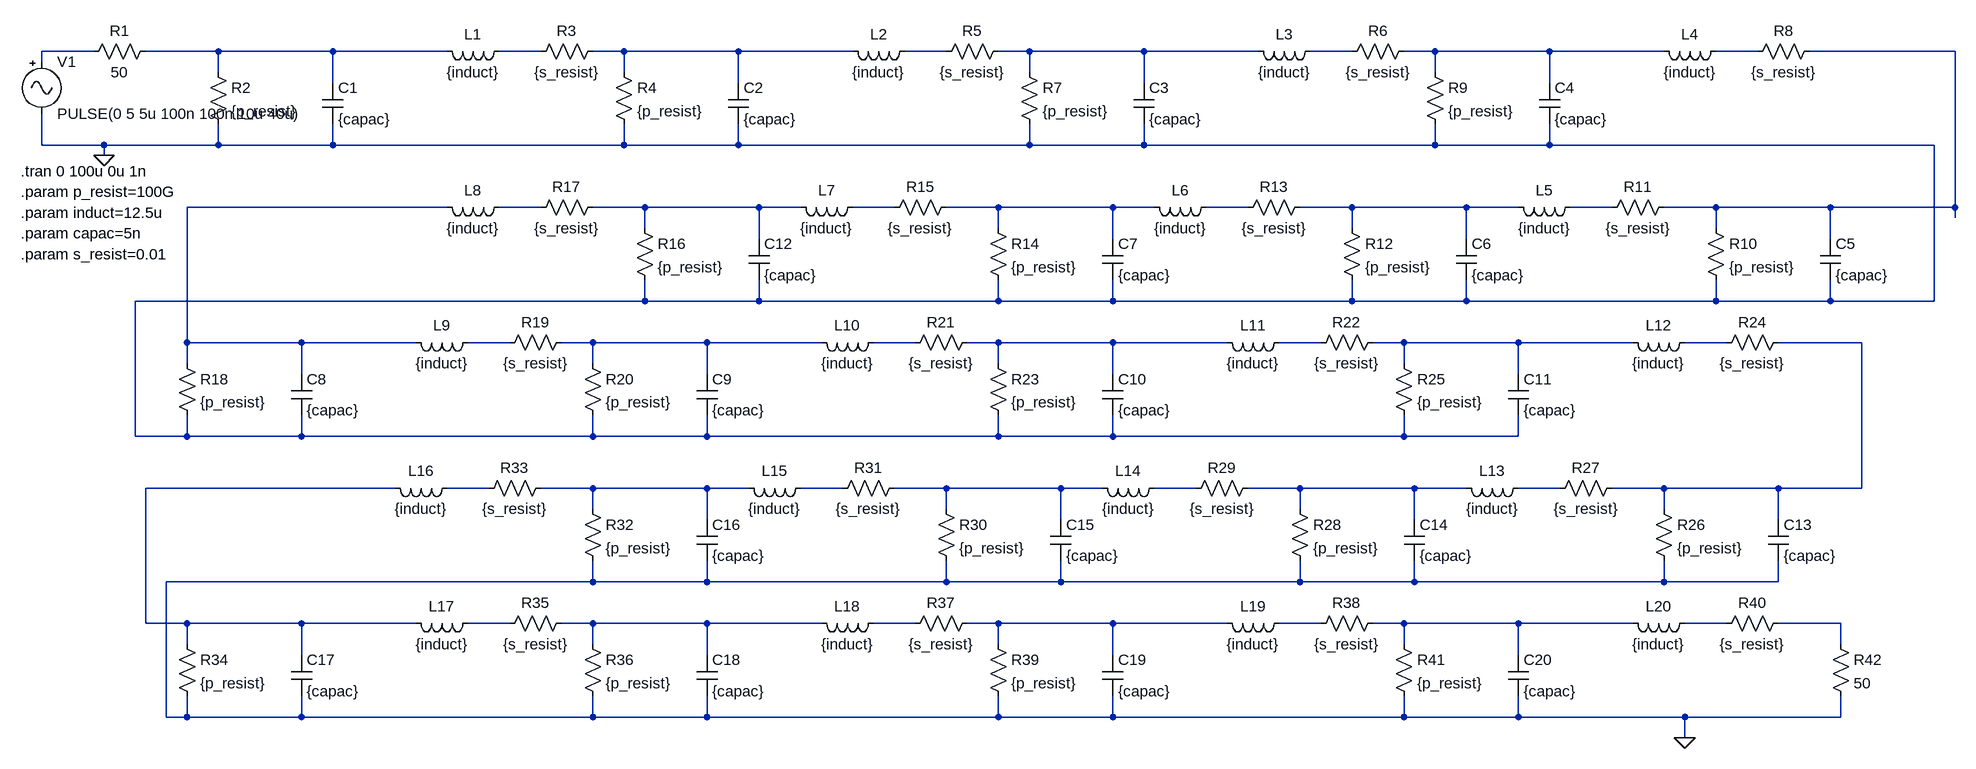
[diagram p0: schematic lossy.asc]
lossy.asc, the LTspice schematic file:
Version 4
SHEET 1 2904 900
WIRE -560 -176 -640 -176
WIRE -368 -176 -480 -176
WIRE -192 -176 -368 -176
WIRE -16 -176 -192 -176
WIRE 128 -176 64 -176
WIRE 256 -176 208 -176
WIRE 432 -176 256 -176
WIRE 608 -176 432 -176
WIRE 752 -176 688 -176
WIRE 880 -176 832 -176
WIRE 1056 -176 880 -176
WIRE 1232 -176 1056 -176
WIRE 1376 -176 1312 -176
WIRE 1504 -176 1456 -176
WIRE 1680 -176 1504 -176
WIRE 1856 -176 1680 -176
WIRE 2000 -176 1936 -176
WIRE 2304 -176 2080 -176
WIRE -640 -160 -640 -176
WIRE -368 -144 -368 -176
WIRE 256 -144 256 -176
WIRE 880 -144 880 -176
WIRE 1504 -144 1504 -176
WIRE -192 -128 -192 -176
WIRE 432 -128 432 -176
WIRE 1056 -128 1056 -176
WIRE 1680 -128 1680 -176
WIRE -640 -32 -640 -80
WIRE -544 -32 -640 -32
WIRE -368 -32 -368 -64
WIRE -368 -32 -544 -32
WIRE -192 -32 -192 -64
WIRE -192 -32 -368 -32
WIRE 256 -32 256 -64
WIRE 256 -32 -192 -32
WIRE 432 -32 432 -64
WIRE 432 -32 256 -32
WIRE 880 -32 880 -64
WIRE 880 -32 432 -32
WIRE 1056 -32 1056 -64
WIRE 1056 -32 880 -32
WIRE 1504 -32 1504 -64
WIRE 1504 -32 1056 -32
WIRE 1680 -32 1680 -64
WIRE 1680 -32 1504 -32
WIRE 2272 -32 1680 -32
WIRE -544 -16 -544 -32
WIRE -16 64 -416 64
WIRE 128 64 64 64
WIRE 288 64 208 64
WIRE 464 64 288 64
WIRE 528 64 464 64
WIRE 672 64 608 64
WIRE 832 64 752 64
WIRE 1008 64 832 64
WIRE 1072 64 1008 64
WIRE 1216 64 1152 64
WIRE 1376 64 1296 64
WIRE 1552 64 1376 64
WIRE 1632 64 1552 64
WIRE 1776 64 1712 64
WIRE 1936 64 1856 64
WIRE 2112 64 1936 64
WIRE 2304 64 2304 -176
WIRE 2304 64 2112 64
WIRE 2304 80 2304 64
WIRE 288 96 288 64
WIRE 832 96 832 64
WIRE 1376 96 1376 64
WIRE 1936 96 1936 64
WIRE 464 112 464 64
WIRE 1008 112 1008 64
WIRE 1552 112 1552 64
WIRE 2112 112 2112 64
WIRE 288 208 288 176
WIRE 288 208 -496 208
WIRE 464 208 464 176
WIRE 464 208 288 208
WIRE 832 208 832 176
WIRE 832 208 464 208
WIRE 1008 208 1008 176
WIRE 1008 208 832 208
WIRE 1376 208 1376 176
WIRE 1376 208 1008 208
WIRE 1552 208 1552 176
WIRE 1552 208 1376 208
WIRE 1936 208 1936 176
WIRE 1936 208 1552 208
WIRE 2112 208 2112 176
WIRE 2112 208 1936 208
WIRE 2272 208 2272 -32
WIRE 2272 208 2112 208
WIRE -416 272 -416 64
WIRE -240 272 -416 272
WIRE -64 272 -240 272
WIRE 80 272 16 272
WIRE 208 272 160 272
WIRE 384 272 208 272
WIRE 560 272 384 272
WIRE 704 272 640 272
WIRE 832 272 784 272
WIRE 1008 272 832 272
WIRE 1184 272 1008 272
WIRE 1328 272 1264 272
WIRE 1456 272 1408 272
WIRE 1632 272 1456 272
WIRE 1808 272 1632 272
WIRE 1952 272 1888 272
WIRE 2160 272 2032 272
WIRE -416 304 -416 272
WIRE 208 304 208 272
WIRE 832 304 832 272
WIRE 1456 304 1456 272
WIRE -240 320 -240 272
WIRE 384 320 384 272
WIRE 1008 320 1008 272
WIRE 1632 320 1632 272
WIRE -496 416 -496 208
WIRE -416 416 -416 384
WIRE -416 416 -496 416
WIRE -240 416 -240 384
WIRE -240 416 -416 416
WIRE 208 416 208 384
WIRE 208 416 -240 416
WIRE 384 416 384 384
WIRE 384 416 208 416
WIRE 832 416 832 384
WIRE 832 416 384 416
WIRE 1008 416 1008 384
WIRE 1008 416 832 416
WIRE 1456 416 1456 384
WIRE 1456 416 1008 416
WIRE 1632 416 1632 384
WIRE 1632 416 1456 416
WIRE -96 496 -480 496
WIRE 48 496 -16 496
WIRE 208 496 128 496
WIRE 384 496 208 496
WIRE 448 496 384 496
WIRE 592 496 528 496
WIRE 752 496 672 496
WIRE 928 496 752 496
WIRE 992 496 928 496
WIRE 1136 496 1072 496
WIRE 1296 496 1216 496
WIRE 1472 496 1296 496
WIRE 1552 496 1472 496
WIRE 1696 496 1632 496
WIRE 1856 496 1776 496
WIRE 2032 496 1856 496
WIRE 2160 496 2160 272
WIRE 2160 496 2032 496
WIRE 208 528 208 496
WIRE 752 528 752 496
WIRE 1296 528 1296 496
WIRE 1856 528 1856 496
WIRE 384 544 384 496
WIRE 928 544 928 496
WIRE 1472 544 1472 496
WIRE 2032 544 2032 496
WIRE 208 640 208 608
WIRE 208 640 -448 640
WIRE 384 640 384 608
WIRE 384 640 208 640
WIRE 752 640 752 608
WIRE 752 640 384 640
WIRE 928 640 928 608
WIRE 928 640 752 640
WIRE 1296 640 1296 608
WIRE 1296 640 928 640
WIRE 1472 640 1472 608
WIRE 1472 640 1296 640
WIRE 1856 640 1856 608
WIRE 1856 640 1472 640
WIRE 2032 640 2032 608
WIRE 2032 640 1856 640
WIRE -480 704 -480 496
WIRE -416 704 -480 704
WIRE -240 704 -416 704
WIRE -64 704 -240 704
WIRE 80 704 16 704
WIRE 208 704 160 704
WIRE 384 704 208 704
WIRE 560 704 384 704
WIRE 704 704 640 704
WIRE 832 704 784 704
WIRE 1008 704 832 704
WIRE 1184 704 1008 704
WIRE 1328 704 1264 704
WIRE 1456 704 1408 704
WIRE 1632 704 1456 704
WIRE 1808 704 1632 704
WIRE 1952 704 1888 704
WIRE 2128 704 2032 704
WIRE -416 736 -416 704
WIRE 208 736 208 704
WIRE 832 736 832 704
WIRE 1456 736 1456 704
WIRE 2128 736 2128 704
WIRE -240 752 -240 704
WIRE 384 752 384 704
WIRE 1008 752 1008 704
WIRE 1632 752 1632 704
WIRE -448 848 -448 640
WIRE -416 848 -416 816
WIRE -416 848 -448 848
WIRE -240 848 -240 816
WIRE -240 848 -416 848
WIRE 208 848 208 816
WIRE 208 848 -240 848
WIRE 384 848 384 816
WIRE 384 848 208 848
WIRE 832 848 832 816
WIRE 832 848 384 848
WIRE 1008 848 1008 816
WIRE 1008 848 832 848
WIRE 1456 848 1456 816
WIRE 1456 848 1008 848
WIRE 1632 848 1632 816
WIRE 1632 848 1456 848
WIRE 1888 848 1632 848
WIRE 2128 848 2128 816
WIRE 2128 848 1888 848
WIRE 1888 880 1888 848
FLAG -544 -16 0
FLAG 1888 880 0
SYMBOL Misc\\signal -640 -176 R0
WINDOW 123 0 0 Left 0
WINDOW 39 0 0 Left 0
SYMATTR InstName V1
SYMATTR Value PULSE(0 5 5u 100n 100n 10u 40u)
SYMBOL res -464 -192 R90
WINDOW 0 0 56 VBottom 2
WINDOW 3 32 56 VTop 2
SYMATTR InstName R1
SYMATTR Value 50
SYMBOL res -384 -160 R0
SYMATTR InstName R2
SYMATTR Value {p_resist}
SYMBOL ind 80 -192 R90
WINDOW 0 5 56 VBottom 2
WINDOW 3 32 56 VTop 2
SYMATTR InstName L1
SYMATTR Value {induct}
SYMBOL cap -208 -128 R0
SYMATTR InstName C1
SYMATTR Value {capac}
SYMBOL res 224 -192 R90
WINDOW 0 0 56 VBottom 2
WINDOW 3 32 56 VTop 2
SYMATTR InstName R3
SYMATTR Value {s_resist}
SYMBOL res 240 -160 R0
SYMATTR InstName R4
SYMATTR Value {p_resist}
SYMBOL ind 704 -192 R90
WINDOW 0 5 56 VBottom 2
WINDOW 3 32 56 VTop 2
SYMATTR InstName L2
SYMATTR Value {induct}
SYMBOL cap 416 -128 R0
SYMATTR InstName C2
SYMATTR Value {capac}
SYMBOL res 848 -192 R90
WINDOW 0 0 56 VBottom 2
WINDOW 3 32 56 VTop 2
SYMATTR InstName R5
SYMATTR Value {s_resist}
SYMBOL ind 1328 -192 R90
WINDOW 0 5 56 VBottom 2
WINDOW 3 32 56 VTop 2
SYMATTR InstName L3
SYMATTR Value {induct}
SYMBOL cap 1040 -128 R0
SYMATTR InstName C3
SYMATTR Value {capac}
SYMBOL res 1472 -192 R90
WINDOW 0 0 56 VBottom 2
WINDOW 3 32 56 VTop 2
SYMATTR InstName R6
SYMATTR Value {s_resist}
SYMBOL res 864 -160 R0
SYMATTR InstName R7
SYMATTR Value {p_resist}
SYMBOL ind 1952 -192 R90
WINDOW 0 5 56 VBottom 2
WINDOW 3 32 56 VTop 2
SYMATTR InstName L4
SYMATTR Value {induct}
SYMBOL cap 1664 -128 R0
SYMATTR InstName C4
SYMATTR Value {capac}
SYMBOL res 2096 -192 R90
WINDOW 0 0 56 VBottom 2
WINDOW 3 32 56 VTop 2
SYMATTR InstName R8
SYMATTR Value {s_resist}
SYMBOL res 1488 -160 R0
SYMATTR InstName R9
SYMATTR Value {p_resist}
SYMBOL cap 2096 112 R0
SYMATTR InstName C5
SYMATTR Value {capac}
SYMBOL res 1920 80 R0
SYMATTR InstName R10
SYMATTR Value {p_resist}
SYMBOL ind 1728 48 R90
WINDOW 0 5 56 VBottom 2
WINDOW 3 32 56 VTop 2
SYMATTR InstName L5
SYMATTR Value {induct}
SYMBOL res 1872 48 R90
WINDOW 0 0 56 VBottom 2
WINDOW 3 32 56 VTop 2
SYMATTR InstName R11
SYMATTR Value {s_resist}
SYMBOL cap 1536 112 R0
SYMATTR InstName C6
SYMATTR Value {capac}
SYMBOL res 1360 80 R0
SYMATTR InstName R12
SYMATTR Value {p_resist}
SYMBOL ind 1168 48 R90
WINDOW 0 5 56 VBottom 2
WINDOW 3 32 56 VTop 2
SYMATTR InstName L6
SYMATTR Value {induct}
SYMBOL res 1312 48 R90
WINDOW 0 0 56 VBottom 2
WINDOW 3 32 56 VTop 2
SYMATTR InstName R13
SYMATTR Value {s_resist}
SYMBOL cap 992 112 R0
SYMATTR InstName C7
SYMATTR Value {capac}
SYMBOL res 816 80 R0
SYMATTR InstName R14
SYMATTR Value {p_resist}
SYMBOL ind 624 48 R90
WINDOW 0 5 56 VBottom 2
WINDOW 3 32 56 VTop 2
SYMATTR InstName L7
SYMATTR Value {induct}
SYMBOL res 768 48 R90
WINDOW 0 0 56 VBottom 2
WINDOW 3 32 56 VTop 2
SYMATTR InstName R15
SYMATTR Value {s_resist}
SYMBOL res 272 80 R0
SYMATTR InstName R16
SYMATTR Value {p_resist}
SYMBOL ind 80 48 R90
WINDOW 0 5 56 VBottom 2
WINDOW 3 32 56 VTop 2
SYMATTR InstName L8
SYMATTR Value {induct}
SYMBOL res 224 48 R90
WINDOW 0 0 56 VBottom 2
WINDOW 3 32 56 VTop 2
SYMATTR InstName R17
SYMATTR Value {s_resist}
SYMBOL res -432 288 R0
SYMATTR InstName R18
SYMATTR Value {p_resist}
SYMBOL ind 32 256 R90
WINDOW 0 5 56 VBottom 2
WINDOW 3 32 56 VTop 2
SYMATTR InstName L9
SYMATTR Value {induct}
SYMBOL cap -256 320 R0
SYMATTR InstName C8
SYMATTR Value {capac}
SYMBOL res 176 256 R90
WINDOW 0 0 56 VBottom 2
WINDOW 3 32 56 VTop 2
SYMATTR InstName R19
SYMATTR Value {s_resist}
SYMBOL res 192 288 R0
SYMATTR InstName R20
SYMATTR Value {p_resist}
SYMBOL ind 656 256 R90
WINDOW 0 5 56 VBottom 2
WINDOW 3 32 56 VTop 2
SYMATTR InstName L10
SYMATTR Value {induct}
SYMBOL cap 368 320 R0
SYMATTR InstName C9
SYMATTR Value {capac}
SYMBOL res 800 256 R90
WINDOW 0 0 56 VBottom 2
WINDOW 3 32 56 VTop 2
SYMATTR InstName R21
SYMATTR Value {s_resist}
SYMBOL ind 1280 256 R90
WINDOW 0 5 56 VBottom 2
WINDOW 3 32 56 VTop 2
SYMATTR InstName L11
SYMATTR Value {induct}
SYMBOL cap 992 320 R0
SYMATTR InstName C10
SYMATTR Value {capac}
SYMBOL res 1424 256 R90
WINDOW 0 0 56 VBottom 2
WINDOW 3 32 56 VTop 2
SYMATTR InstName R22
SYMATTR Value {s_resist}
SYMBOL res 816 288 R0
SYMATTR InstName R23
SYMATTR Value {p_resist}
SYMBOL ind 1904 256 R90
WINDOW 0 5 56 VBottom 2
WINDOW 3 32 56 VTop 2
SYMATTR InstName L12
SYMATTR Value {induct}
SYMBOL cap 1616 320 R0
SYMATTR InstName C11
SYMATTR Value {capac}
SYMBOL res 2048 256 R90
WINDOW 0 0 56 VBottom 2
WINDOW 3 32 56 VTop 2
SYMATTR InstName R24
SYMATTR Value {s_resist}
SYMBOL res 1440 288 R0
SYMATTR InstName R25
SYMATTR Value {p_resist}
SYMBOL cap 448 112 R0
SYMATTR InstName C12
SYMATTR Value {capac}
SYMBOL cap 2016 544 R0
SYMATTR InstName C13
SYMATTR Value {capac}
SYMBOL res 1840 512 R0
SYMATTR InstName R26
SYMATTR Value {p_resist}
SYMBOL ind 1648 480 R90
WINDOW 0 5 56 VBottom 2
WINDOW 3 32 56 VTop 2
SYMATTR InstName L13
SYMATTR Value {induct}
SYMBOL res 1792 480 R90
WINDOW 0 0 56 VBottom 2
WINDOW 3 32 56 VTop 2
SYMATTR InstName R27
SYMATTR Value {s_resist}
SYMBOL cap 1456 544 R0
SYMATTR InstName C14
SYMATTR Value {capac}
SYMBOL res 1280 512 R0
SYMATTR InstName R28
SYMATTR Value {p_resist}
SYMBOL ind 1088 480 R90
WINDOW 0 5 56 VBottom 2
WINDOW 3 32 56 VTop 2
SYMATTR InstName L14
SYMATTR Value {induct}
SYMBOL res 1232 480 R90
WINDOW 0 0 56 VBottom 2
WINDOW 3 32 56 VTop 2
SYMATTR InstName R29
SYMATTR Value {s_resist}
SYMBOL cap 912 544 R0
SYMATTR InstName C15
SYMATTR Value {capac}
SYMBOL res 736 512 R0
SYMATTR InstName R30
SYMATTR Value {p_resist}
SYMBOL ind 544 480 R90
WINDOW 0 5 56 VBottom 2
WINDOW 3 32 56 VTop 2
SYMATTR InstName L15
SYMATTR Value {induct}
SYMBOL res 688 480 R90
WINDOW 0 0 56 VBottom 2
WINDOW 3 32 56 VTop 2
SYMATTR InstName R31
SYMATTR Value {s_resist}
SYMBOL res 192 512 R0
SYMATTR InstName R32
SYMATTR Value {p_resist}
SYMBOL ind 0 480 R90
WINDOW 0 5 56 VBottom 2
WINDOW 3 32 56 VTop 2
SYMATTR InstName L16
SYMATTR Value {induct}
SYMBOL res 144 480 R90
WINDOW 0 0 56 VBottom 2
WINDOW 3 32 56 VTop 2
SYMATTR InstName R33
SYMATTR Value {s_resist}
SYMBOL cap 368 544 R0
SYMATTR InstName C16
SYMATTR Value {capac}
SYMBOL res -432 720 R0
SYMATTR InstName R34
SYMATTR Value {p_resist}
SYMBOL ind 32 688 R90
WINDOW 0 5 56 VBottom 2
WINDOW 3 32 56 VTop 2
SYMATTR InstName L17
SYMATTR Value {induct}
SYMBOL cap -256 752 R0
SYMATTR InstName C17
SYMATTR Value {capac}
SYMBOL res 176 688 R90
WINDOW 0 0 56 VBottom 2
WINDOW 3 32 56 VTop 2
SYMATTR InstName R35
SYMATTR Value {s_resist}
SYMBOL res 192 720 R0
SYMATTR InstName R36
SYMATTR Value {p_resist}
SYMBOL ind 656 688 R90
WINDOW 0 5 56 VBottom 2
WINDOW 3 32 56 VTop 2
SYMATTR InstName L18
SYMATTR Value {induct}
SYMBOL cap 368 752 R0
SYMATTR InstName C18
SYMATTR Value {capac}
SYMBOL res 800 688 R90
WINDOW 0 0 56 VBottom 2
WINDOW 3 32 56 VTop 2
SYMATTR InstName R37
SYMATTR Value {s_resist}
SYMBOL ind 1280 688 R90
WINDOW 0 5 56 VBottom 2
WINDOW 3 32 56 VTop 2
SYMATTR InstName L19
SYMATTR Value {induct}
SYMBOL cap 992 752 R0
SYMATTR InstName C19
SYMATTR Value {capac}
SYMBOL res 1424 688 R90
WINDOW 0 0 56 VBottom 2
WINDOW 3 32 56 VTop 2
SYMATTR InstName R38
SYMATTR Value {s_resist}
SYMBOL res 816 720 R0
SYMATTR InstName R39
SYMATTR Value {p_resist}
SYMBOL ind 1904 688 R90
WINDOW 0 5 56 VBottom 2
WINDOW 3 32 56 VTop 2
SYMATTR InstName L20
SYMATTR Value {induct}
SYMBOL cap 1616 752 R0
SYMATTR InstName C20
SYMATTR Value {capac}
SYMBOL res 2048 688 R90
WINDOW 0 0 56 VBottom 2
WINDOW 3 32 56 VTop 2
SYMATTR InstName R40
SYMATTR Value {s_resist}
SYMBOL res 1440 720 R0
SYMATTR InstName R41
SYMATTR Value {p_resist}
SYMBOL res 2112 720 R0
SYMATTR InstName R42
SYMATTR Value 50
TEXT -672 8 Left 2 !.tran 0 100u 0u 1n
TEXT -672 40 Left 2 !.param p_resist=100G
TEXT -672 72 Left 2 !.param induct=12.5u
TEXT -672 104 Left 2 !.param capac=5n
TEXT -672 136 Left 2 !.param s_resist=0.01

The netlist it stands for:
* lossy.asc
V1 N001 0 PULSE(0 5 5u 100n 100n 10u 40u)
R1 N002 N001 50
R2 N002 0 {p_resist}
L1 N003 N002 {induct}
C1 N002 0 {capac}
R3 N004 N003 {s_resist}
R4 N004 0 {p_resist}
L2 N005 N004 {induct}
C2 N004 0 {capac}
R5 N006 N005 {s_resist}
L3 N007 N006 {induct}
C3 N006 0 {capac}
R6 N008 N007 {s_resist}
R7 N006 0 {p_resist}
L4 N009 N008 {induct}
C4 N008 0 {capac}
R8 N010 N009 {s_resist}
R9 N008 0 {p_resist}
C5 N010 0 {capac}
R10 N010 0 {p_resist}
L5 N018 N017 {induct}
R11 N010 N018 {s_resist}
C6 N017 0 {capac}
R12 N017 0 {p_resist}
L6 N016 N015 {induct}
R13 N017 N016 {s_resist}
C7 N015 0 {capac}
R14 N015 0 {p_resist}
L7 N014 N013 {induct}
R15 N015 N014 {s_resist}
R16 N013 0 {p_resist}
L8 N012 N011 {induct}
R17 N013 N012 {s_resist}
R18 N011 0 {p_resist}
L9 N019 N011 {induct}
C8 N011 0 {capac}
R19 N020 N019 {s_resist}
R20 N020 0 {p_resist}
L10 N021 N020 {induct}
C9 N020 0 {capac}
R21 N022 N021 {s_resist}
L11 N023 N022 {induct}
C10 N022 0 {capac}
R22 N024 N023 {s_resist}
R23 N022 0 {p_resist}
L12 N025 N024 {induct}
C11 N024 0 {capac}
R24 N026 N025 {s_resist}
R25 N024 0 {p_resist}
C12 N013 0 {capac}
C13 N026 0 {capac}
R26 N026 0 {p_resist}
L13 N034 N033 {induct}
R27 N026 N034 {s_resist}
C14 N033 0 {capac}
R28 N033 0 {p_resist}
L14 N032 N031 {induct}
R29 N033 N032 {s_resist}
C15 N031 0 {capac}
R30 N031 0 {p_resist}
L15 N030 N029 {induct}
R31 N031 N030 {s_resist}
R32 N029 0 {p_resist}
L16 N028 N027 {induct}
R33 N029 N028 {s_resist}
C16 N029 0 {capac}
R34 N027 0 {p_resist}
L17 N035 N027 {induct}
C17 N027 0 {capac}
R35 N036 N035 {s_resist}
R36 N036 0 {p_resist}
L18 N037 N036 {induct}
C18 N036 0 {capac}
R37 N038 N037 {s_resist}
L19 N039 N038 {induct}
C19 N038 0 {capac}
R38 N040 N039 {s_resist}
R39 N038 0 {p_resist}
L20 N041 N040 {induct}
C20 N040 0 {capac}
R40 N042 N041 {s_resist}
R41 N040 0 {p_resist}
R42 N042 0 50
.tran 0 100u 0u 1n
.param p_resist=100G
.param induct=12.5u
.param capac=5n
.param s_resist=0.01
.backanno
.end